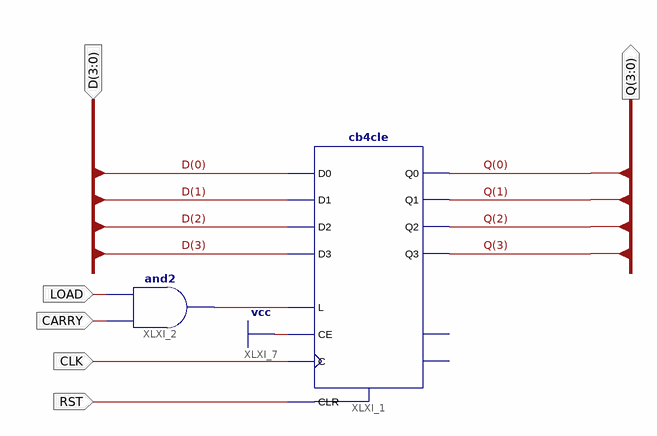
[diagram p0: schematic sheet 1]
// Xilinx ISE schematic my_program_counter.sch (virtex6) as structural Verilog: 2 symbols, 6 ports
module my_program_counter (
  input  RST,
  input  CLK,
  input  [3:0] D,
  input  LOAD,
  input  CARRY,
  output [3:0] Q
);

  wire XLXN_8;

  cb4cle XLXI_1 (
    .C(CLK), .CE(1'b1), .CLR(RST), .D0(D[0]), .D1(D[1]), .D2(D[2]), .D3(D[3]), .L(XLXN_8), .Q0(Q[0]),
    .Q1(Q[1]), .Q2(Q[2]), .Q3(Q[3]));  // open: CEO, TC
  and XLXI_2 (XLXN_8, CARRY, LOAD);
endmodule
